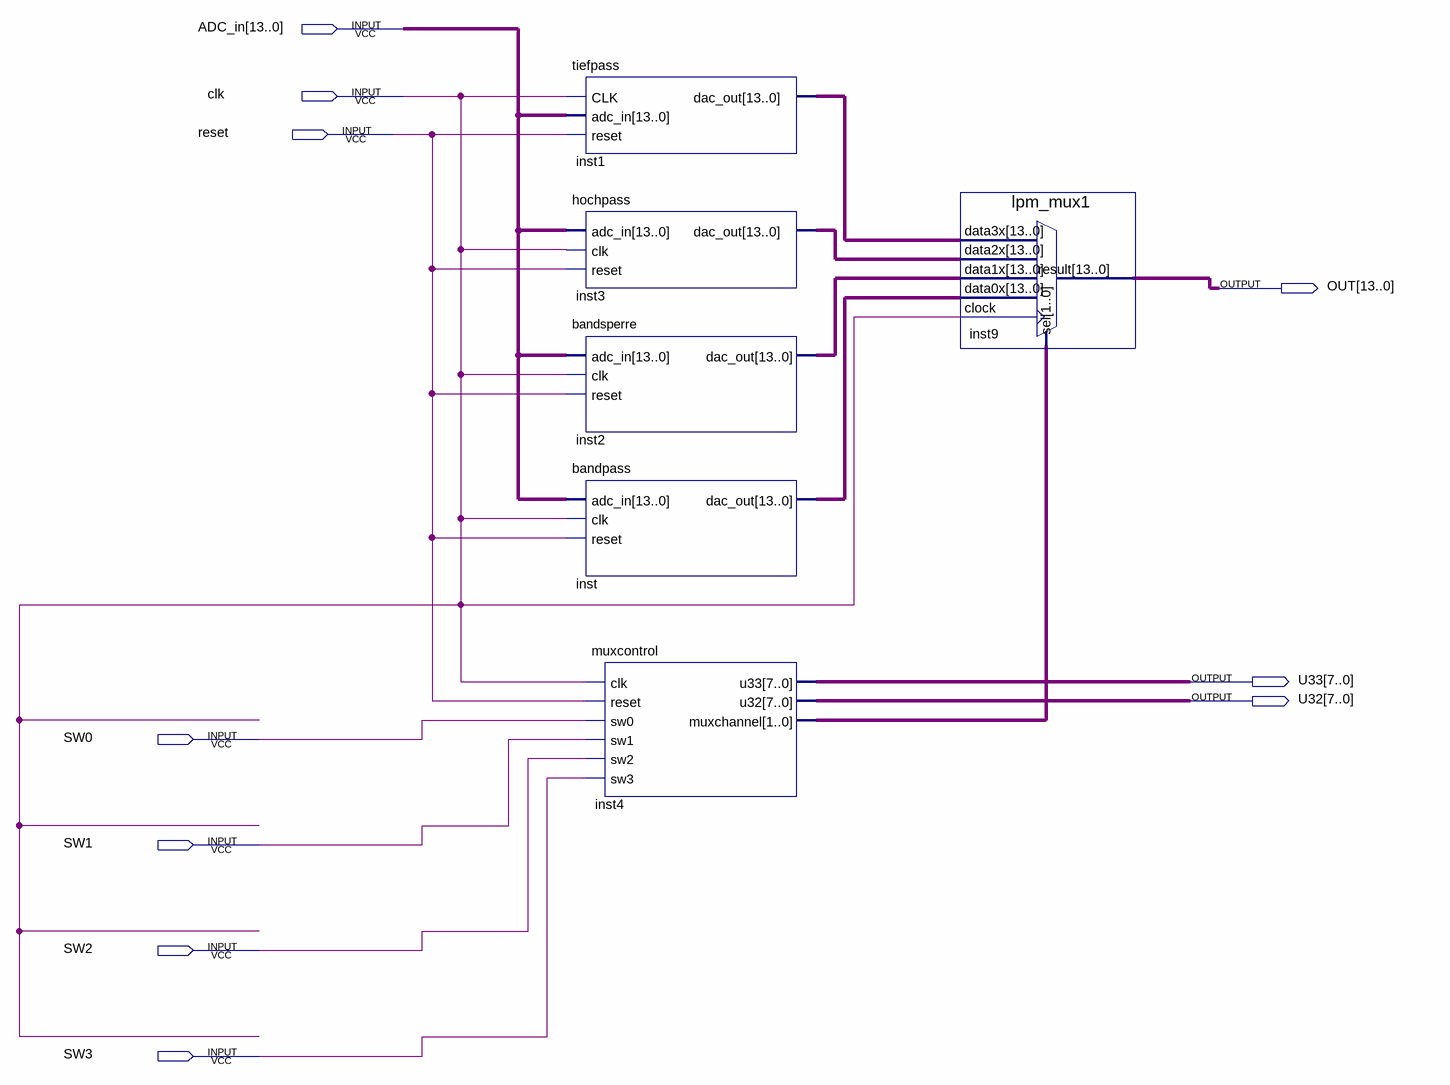
[diagram p0: schematic sheet]
// Quartus schematic AlleFilter.bdf as structural Verilog: 6 symbols, 10 pins
module AlleFilter (
  input  [13:0] ADC_in,
  input  clk,
  input  reset,
  input  SW0,
  input  SW1,
  input  SW2,
  input  SW3,
  output [13:0] OUT,
  output [7:0] U33,
  output [7:0] U32
);

  wire [1:0] inst4_muxchannel;
  wire [13:0] inst1_dac_out, inst2_dac_out, inst3_dac_out, inst_dac_out;

  tiefpass inst1 (.CLK(clk), .adc_in(ADC_in), .reset(reset), .dac_out(inst1_dac_out));
  hochpass inst3 (.adc_in(ADC_in), .clk(clk), .reset(reset), .dac_out(inst3_dac_out));
  bandsperre inst2 (.adc_in(ADC_in), .clk(clk), .reset(reset), .dac_out(inst2_dac_out));
  bandpass inst (.adc_in(ADC_in), .clk(clk), .reset(reset), .dac_out(inst_dac_out));
  muxcontrol inst4 (
    .clk(clk), .reset(reset), .sw0(SW0), .sw1(SW1), .sw2(SW2), .sw3(SW3), .u33(U33), .u32(U32),
    .muxchannel(inst4_muxchannel));
  lpm_mux1 inst9 (
    .data3x(inst1_dac_out), .data2x(inst3_dac_out), .data1x(inst2_dac_out), .data0x(inst_dac_out),
    .clock(clk), .sel(inst4_muxchannel), .result(OUT));
endmodule
